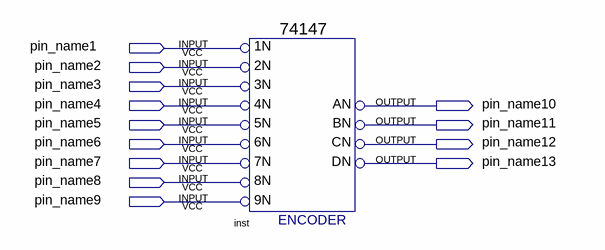
[diagram p0: schematic sheet]
// Quartus schematic a74147a.bdf as structural Verilog: 1 symbols, 13 pins
module a74147a (
  input  pin_name1,
  input  pin_name2,
  input  pin_name3,
  input  pin_name4,
  input  pin_name5,
  input  pin_name6,
  input  pin_name7,
  input  pin_name8,
  input  pin_name9,
  output pin_name10,
  output pin_name11,
  output pin_name12,
  output pin_name13
);

  \74147  inst (
    .\1N (pin_name1), .\2N (pin_name2), .\3N (pin_name3), .\6N (pin_name6), .\5N (pin_name5),
    .\4N (pin_name4), .\9N (pin_name9), .\8N (pin_name8), .\7N (pin_name7), .CN(pin_name12), .BN(pin_name11),
    .AN(pin_name10), .DN(pin_name13));
endmodule
